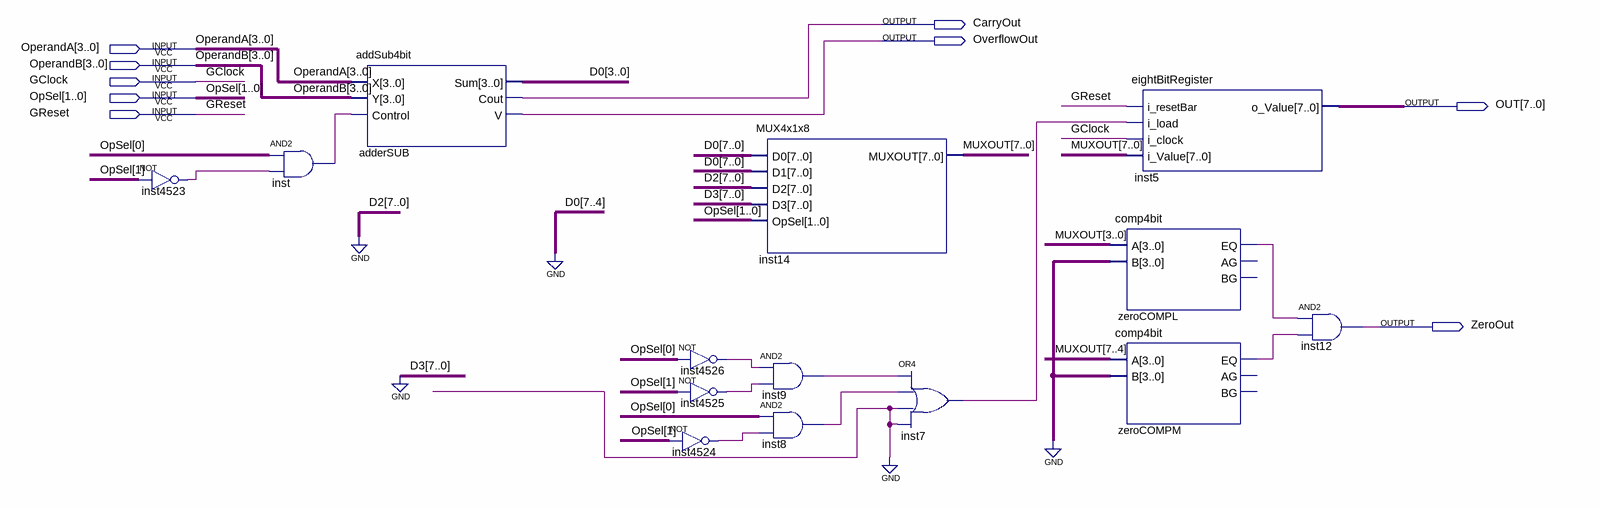
[diagram p0: schematic sheet]
// Quartus schematic fixedPointALU.bdf as structural Verilog: 14 symbols, 9 pins
module fixedPointALU (
  input  [3:0] OperandA,
  input  [3:0] OperandB,
  input  GClock,
  input  [1:0] OpSel,
  input  GReset,
  output CarryOut,
  output OverflowOut,
  output [7:0] OUT,
  output ZeroOut
);

  wire inst7_out, inst8_out, inst9_out, inst4523_out, inst4524_out, inst4525_out, inst4526_out, inst_out,
       zeroCOMPL_eq, zeroCOMPM_eq;
  wire [3:0] D0;
  wire [7:0] MUXOUT;

  not inst4523 (inst4523_out, OpSel[1]);
  and inst (inst_out, OpSel[0], inst4523_out);
  addSub4bit adderSUB (.X(OperandA), .Y(OperandB), .Control(inst_out), .Sum(D0), .Cout(CarryOut), .V(OverflowOut));
  not inst4526 (inst4526_out, OpSel[0]);
  not inst4525 (inst4525_out, OpSel[1]);
  not inst4524 (inst4524_out, OpSel[1]);
  MUX4x1x8 inst14 (
    .D0({4'b0000, D0}), .D1({4'b0000, D0}), .D2({8{1'b0}}), .D3({8{1'b0}}), .OpSel(OpSel), .MUXOUT(MUXOUT));
  and inst9 (inst9_out, inst4526_out, inst4525_out);
  and inst8 (inst8_out, OpSel[0], inst4524_out);
  or inst7 (inst7_out, inst9_out, inst8_out, 1'b0, 1'b0);
  eightBitRegister inst5 (.i_resetBar(GReset), .i_load(inst7_out), .i_clock(GClock), .i_Value(MUXOUT), .o_Value(OUT));
  comp4bit zeroCOMPL (.A(MUXOUT[3:0]), .B(4'b0000), .EQ(zeroCOMPL_eq));  // open: AG, BG
  comp4bit zeroCOMPM (.A(MUXOUT[7:4]), .B(4'b0000), .EQ(zeroCOMPM_eq));  // open: AG, BG
  and inst12 (ZeroOut, zeroCOMPL_eq, zeroCOMPM_eq);
endmodule
